# Altium schematic sheet Driver4.SchDoc
size A4; SheetNumber: 6; SheetTotal: 8
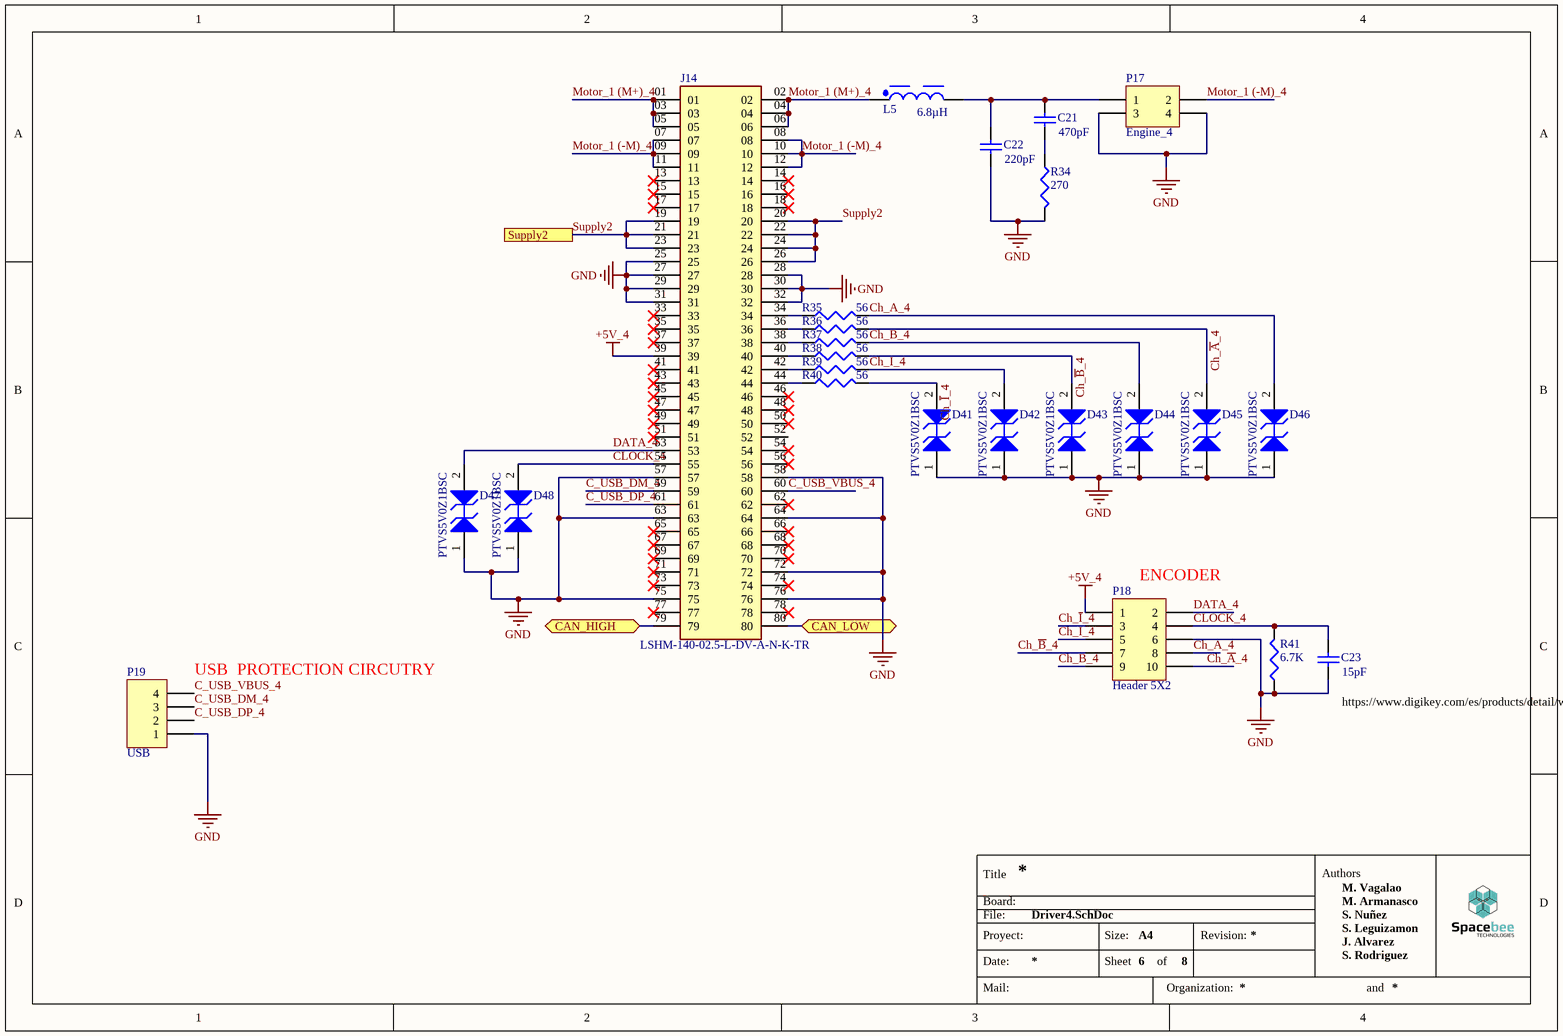
[diagram p0: Driver4.SchDoc]

## Parts
C21  value 470pF  [1608[0603]]  (hidden comment: Cap Semi)
C22  value 220pF  [1608[0603]]  (hidden comment: Cap Semi)
C23  value 15pF  [1608[0603]]  (hidden comment: Cap Semi)
D41  PTVS5V0Z1BSC  [SOD993B]
D42  PTVS5V0Z1BSC  [SOD993B]
D43  PTVS5V0Z1BSC  [SOD993B]
D44  PTVS5V0Z1BSC  [SOD993B]
D45  PTVS5V0Z1BSC  [SOD993B]
D46  PTVS5V0Z1BSC  [SOD993B]
D47  PTVS5V0Z1BSC  [SOD993B]
D48  PTVS5V0Z1BSC  [SOD993B]
J14  LSHM-140-02.5-L-DV-A-N-K-TR  [SAMTEC_LSHM-140-02.5-L-DV-A-N-K-TR]
L5  6.8µH  [WE-XHMA_6060]
P17  Engine_4  [MOLEX_1724480004]
P18  Header 5X2  [CONN_HIF3FC-14PA-2.54DS(71)_HIR]
P19  USB  [HDR1X4]
R34  value 270  [J1-0603]  (hidden comment: Res3)
R35  value 56  [J1-0603]  (hidden comment: Res3)
R36  value 56  [J1-0603]  (hidden comment: Res3)
R37  value 56  [J1-0603]  (hidden comment: Res3)
R38  value 56  [J1-0603]  (hidden comment: Res3)
R39  value 56  [J1-0603]  (hidden comment: Res3)
R40  value 56  [J1-0603]  (hidden comment: Res3)
R41  value 6.7K  [J1-0603]  (hidden comment: Res3)

## Ports
CAN_HIGH (bidir), CAN_LOW (bidir), Supply2

## Nets
+5V_4: J14.39 P18.1
GND: C22.2 C23.2 D41.1(A1) D42.1(A1) D43.1(A1) D44.1(A1) D45.1(A1) D46.1(A1) D47.1(A1) D48.1(A1) J14.25 J14.27 J14.28 J14.29 J14.30 J14.31 J14.32 J14.57 J14.58 J14.63 J14.64 J14.72 J14.75 J14.76 P17.3 P17.4 P18.6 P19.1 R34.2 R41.1
C_USB_DM_4: J14.59 P19.3
C_USB_DP_4: J14.61 P19.2
C_USB_VBUS_4: J14.60 P19.4
CAN_HIGH: J14.79 ; port CAN_HIGH
CAN_LOW: J14.80 ; port CAN_LOW
Ch_~{A}_4: D45.2(A2) P18.10 R36.2
Ch_A_4: D46.2(A2) P18.8 R35.2
Ch_~{B}_4: D43.2(A2) P18.7 R38.2
Ch_B_4: D44.2(A2) P18.9 R37.2
Ch_~{I}_4: D41.2(A2) P18.3 R40.2
Ch_I_4: D42.2(A2) P18.5 R39.2
CLOCK_4: C23.1 D48.2(A2) J14.55 P18.4 R41.2
DATA_4: D47.2(A2) J14.53 P18.2
Motor_1 (-M)_4: J14.07 J14.08 J14.09 J14.10 J14.11 J14.12 P17.2
Motor_1 (M+)_4: J14.01 J14.02 J14.03 J14.04 J14.05 J14.06 L5.1
Supply2: J14.19 J14.20 J14.21 J14.22 J14.23 J14.24 J14.26 ; port Supply2
NetC21_1: C21.1 C22.1 L5.2 P17.1
NetC21_2: C21.2 R34.1
NetJ14_34: J14.34 R35.1
NetJ14_36: J14.36 R36.1
NetJ14_38: J14.38 R37.1
NetJ14_40: J14.40 R38.1
NetJ14_42: J14.42 R39.1
NetJ14_44: J14.44 R40.1

Not connected (* = marked no-connect by the designer): J14 13* 14* 15* 16* 17* 18* 33* 35* 37* 41* 43* 45* 46* 47* 48* 49* 50* 51* 52 54* 56* 62* 65* 66* 67* 68* 69* 70* 71* 73* 74* 77* 78*

## Notes on the sheet
- (near P18) ENCODER
- (near P19) USB  PROTECTION CIRCUTRY
- (near C23) https://www.digikey.com/es/products/detail/würth-elektronik/9774050243R/5320640?s=N4IgTCBcDaIJwHYEBYAMBWVZkGYBKIAugL5A
- Title
- Board:
- File:
- Authors
- M. Armanasco
- S. Nuñez
- M. Vagalao
- Proyect:
- Date:
- Mail:
- Size:
- Sheet
- A4
- of
- Organization:
- Revision:
- S. Rodriguez
- S. Leguizamon
- J. Alvarez
- and

## Library data of the parts
C21-C23 = Cap Semi: Capacitor (Semiconductor SIM Model); Published: 8-Jun-2000; LatestRevisionDate: 29-May-2009; LatestRevisionNote: IPC-7351 Footprint Added.; PackageReference: C1206; Publisher: Altium Limited; PackageDescription: Chip Capacitor
D41-D48 = PTVS5V0Z1BSC: Manufacturer: On Semiconductor; PartNumber: 1SMB16CAT3; Direction: Bidirectional; IR Max (uA): 5; Packing: Tape and Reel; PPK Max (W): 600; V(BR) Typ (V): 18.74; DatasheetVersion: Rev. A; PackageVersion: Rev. A, 01/2000; PackageReference: SMB-2-403C-01; PackageDescription: 2-Pin Small Molded Package, J-Bend Lead, Body 4.315 x 3.555 mm; Supplier 1: Digi-Key; Supplier Part Number 1: 1SMB16CAT3OSTR-ND; Supplier 2: Digi-Key; Supplier Part Number 2: 1SMB16CAT3OSCT-ND; Supplier 3: Digi-Key; Supplier Part Number 3: 1SMB16CAT3OSDKR-ND; Mounting Technology: Surface Mount; ComponentLink1Description: Manufacturer URL; ComponentLink1URL: http://www.onsemi.com/; ComponentLink2Description: Datasheet; ComponentLink2URL: http://www.onsemi.com/pub_link/Collateral/1SMB10CAT3-D.PDF; ComponentLink3Description: Package Specification; ComponentLink3URL: http://www.onsemi.com/pub_link/Collateral/1SMB10CAT3-D.PDF
J14 = LSHM-140-02.5-L-DV-A-N-K-TR: LSHM - Samtec 0.50mm Razor Beam High-Speed Hermaphroditic Terminal / Socket Strip.; Price: None; MP: LSHM-140-02.5-L-DV-A-N-K-TR; Availability: Unavailable; Value: *; Package: None
L5 = 78439369068: WE-XHMA SMD Power Inductor, size 1090, 6.8µH, 10.5A, 7.16mΩ; Manufacturer: Wurth Elektronik; Case/Size Code: 1090; Inductance Tolerance: 20%; Saturation Current: 23.25A; Self Resonant Frequency: 16MHz; ComponentLink1Description: Website Link; ComponentLink1URL: https://www.we-online.com/redexpert/article/78439369068?ad; ComponentLink2Description: Datasheet Link; ComponentLink2URL: https://www.we-online.com/redexpert/spec/78439369068?ad; Manufacturer Part Number: 78439369068; Category: Shielded Power Inductors; Match Code: WE-XHMA; Mount: Surface Mount; Operating Temperature Max: 125°C; Operating Temperature Min: -40°C; Packaging: Tape and Reel; Length: 11.6mm; Width: 10.5mm; Height: 8.8mm; DC Resistance: 7.16mΩ; Inductance: 6.8µH; Rated Current: 10.5A
P17 = Header 2X2: Header, 2-Pin, Dual row; LatestRevisionDate: 17-Jul-2002; LatestRevisionNote: Re-released for DXP Platform.; Publisher: Altium Limited
P18 = Header 5X2: Header, 5-Pin, Dual row; LatestRevisionDate: 17-Jul-2002; LatestRevisionNote: Re-released for DXP Platform.; Publisher: Altium Limited
P19 = Header 4: Header, 4-Pin; LatestRevisionDate: 17-Jul-2002; LatestRevisionNote: Re-released for DXP Platform.; Publisher: Altium Limited
R34-R41 = Res3: Resistor; Published: 8-Jun-2000; LatestRevisionDate: 29-May-2009; LatestRevisionNote: IPC-7351 Footprint Added.; PackageReference: J1-0603; Publisher: Altium Limited; PackageDescription: Chip Resistor